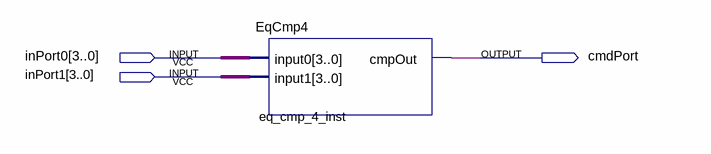
[diagram p0: schematic sheet]
// Quartus schematic EqCmpDemo.bdf as structural Verilog: 1 symbols, 3 pins
module EqCmpDemo (
  input  [3:0] inPort0,
  input  [3:0] inPort1,
  output cmdPort
);

  EqCmp4 eq_cmp_4_inst (.input0(inPort0), .input1(inPort1), .cmpOut(cmdPort));
endmodule
